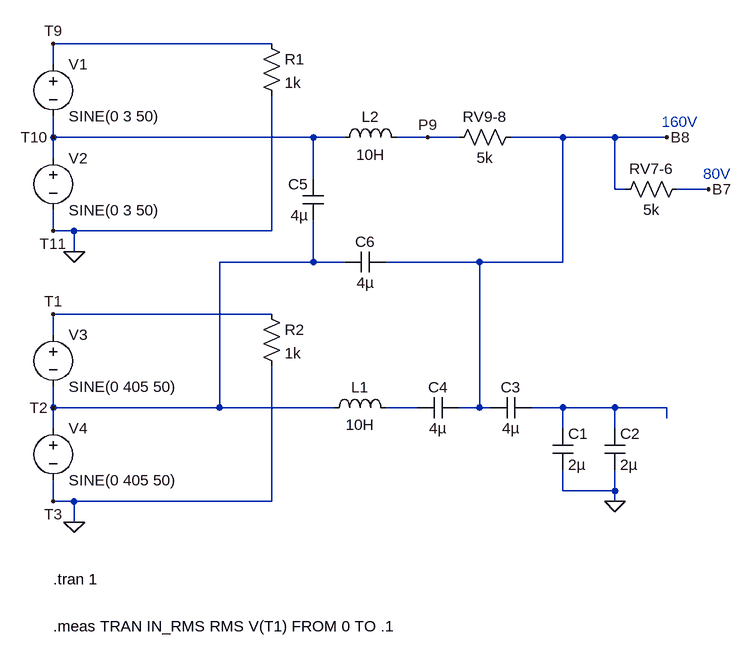
[diagram p0: schematic Ferrix-BL4-3.asc]
Ferrix-BL4-3.asc, the LTspice schematic file:
Version 4
SHEET 1 1812 1756
WIRE 96 144 -240 144
WIRE -240 176 -240 144
WIRE -240 288 -240 256
WIRE 160 288 -240 288
WIRE 208 288 160 288
WIRE 336 288 288 288
WIRE 384 288 336 288
WIRE 544 288 464 288
WIRE 624 288 544 288
WIRE 704 288 624 288
WIRE -240 320 -240 288
WIRE 160 352 160 288
WIRE 624 368 624 288
WIRE 640 368 624 368
WIRE 768 368 720 368
WIRE -240 432 -240 400
WIRE -208 432 -240 432
WIRE 96 432 96 224
WIRE 96 432 -208 432
WIRE -208 464 -208 432
WIRE 160 480 160 416
WIRE 160 480 16 480
WIRE 208 480 160 480
WIRE 416 480 272 480
WIRE 544 480 544 288
WIRE 544 480 416 480
WIRE 96 560 -240 560
WIRE -240 592 -240 560
WIRE -240 704 -240 672
WIRE 16 704 16 480
WIRE 16 704 -240 704
WIRE 192 704 16 704
WIRE 320 704 272 704
WIRE 416 704 416 480
WIRE 416 704 384 704
WIRE 432 704 416 704
WIRE 544 704 496 704
WIRE 624 704 544 704
WIRE 704 704 624 704
WIRE 704 720 704 704
WIRE -240 736 -240 704
WIRE 544 736 544 704
WIRE 624 736 624 704
WIRE 544 832 544 800
WIRE 624 832 624 800
WIRE 624 832 544 832
WIRE -240 848 -240 816
WIRE -208 848 -240 848
WIRE 96 848 96 640
WIRE 96 848 -208 848
WIRE 624 848 624 832
WIRE -208 880 -208 848
FLAG -208 464 0
FLAG -240 144 T9
FLAG -240 288 T10
FLAG -240 432 T11
FLAG -208 880 0
FLAG -240 560 T1
FLAG -240 704 T2
FLAG -240 848 T3
FLAG 336 288 P9
FLAG 704 288 B8
FLAG 768 368 B7
FLAG 624 848 0
SYMBOL voltage -240 160 R0
WINDOW 123 0 0 Left 0
WINDOW 39 0 0 Left 0
SYMATTR InstName V1
SYMATTR Value SINE(0 3 50)
SYMBOL voltage -240 304 R0
WINDOW 123 0 0 Left 0
WINDOW 39 0 0 Left 0
SYMATTR InstName V2
SYMATTR Value SINE(0 3 50)
SYMBOL res 80 128 R0
SYMATTR InstName R1
SYMATTR Value 1k
SYMBOL voltage -240 576 R0
WINDOW 123 0 0 Left 0
WINDOW 39 0 0 Left 0
SYMATTR InstName V3
SYMATTR Value SINE(0 405 50)
SYMBOL voltage -240 720 R0
WINDOW 123 0 0 Left 0
WINDOW 39 0 0 Left 0
SYMATTR InstName V4
SYMATTR Value SINE(0 405 50)
SYMBOL res 80 544 R0
SYMATTR InstName R2
SYMATTR Value 1k
SYMBOL cap 176 416 R180
WINDOW 0 24 56 Left 2
WINDOW 3 24 8 Left 2
SYMATTR InstName C5
SYMATTR Value 4µ
SYMBOL cap 608 736 R0
SYMATTR InstName C2
SYMATTR Value 2µ
SYMBOL ind 176 720 R270
WINDOW 0 32 56 VTop 2
WINDOW 3 5 56 VBottom 2
SYMATTR InstName L1
SYMATTR Value 10H
SYMBOL ind 192 304 R270
WINDOW 0 32 56 VTop 2
WINDOW 3 5 56 VBottom 2
SYMATTR InstName L2
SYMATTR Value 10H
SYMBOL cap 272 464 R90
WINDOW 0 0 32 VBottom 2
WINDOW 3 32 32 VTop 2
SYMATTR InstName C6
SYMATTR Value 4µ
SYMBOL cap 528 736 R0
SYMATTR InstName C1
SYMATTR Value 2µ
SYMBOL cap 496 688 R90
WINDOW 0 0 32 VBottom 2
WINDOW 3 32 32 VTop 2
SYMATTR InstName C3
SYMATTR Value 4µ
SYMBOL cap 384 688 R90
WINDOW 0 0 32 VBottom 2
WINDOW 3 32 32 VTop 2
SYMATTR InstName C4
SYMATTR Value 4µ
SYMBOL res 480 272 R90
WINDOW 0 0 56 VBottom 2
WINDOW 3 32 56 VTop 2
SYMATTR InstName RV9-8
SYMATTR Value 5k
SYMBOL res 736 352 R90
WINDOW 0 0 56 VBottom 2
WINDOW 3 32 56 VTop 2
SYMATTR InstName RV7-6
SYMATTR Value 5k
TEXT -240 968 Left 2 !.tran 1
TEXT -240 1040 Left 2 !.meas TRAN IN_RMS RMS V(T1) FROM 0 TO .1
TEXT 696 264 Left 2 ;160V
TEXT 760 344 Left 2 ;80V

The netlist it stands for:
* Ferrix-BL4-3.asc
V1 T9 T10 SINE(0 3 50)
V2 T10 0 SINE(0 3 50)
R1 T9 0 1k
V3 T1 T2 SINE(0 405 50)
V4 T2 0 SINE(0 405 50)
R2 T1 0 1k
C5 T2 T10 4µ
C2 N002 0 2µ
L1 T2 N001 10H
L2 T10 P9 10H
C6 B8 T2 4µ
C1 N002 0 2µ
C3 N002 B8 4µ
C4 B8 N001 4µ
RV9-8 B8 P9 5k
RV7-6 B7 B8 5k
.tran 1
.meas TRAN IN_RMS RMS V(T1) FROM 0 TO .1
* 160V
* 80V
.backanno
.end